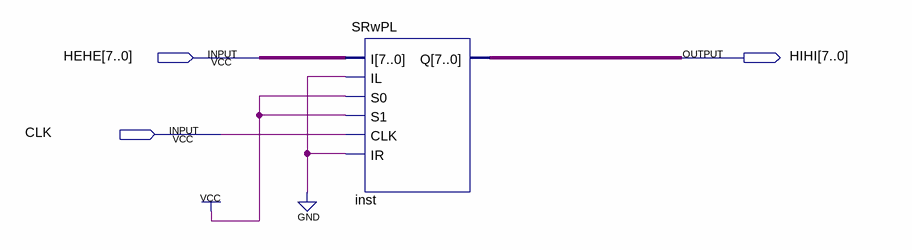
[diagram p0: schematic sheet]
// Quartus schematic TEST.bdf as structural Verilog: 1 symbols, 3 pins
module TEST (
  input  [7:0] HEHE,
  input  CLK,
  output [7:0] HIHI
);

  SRwPL inst (.I(HEHE), .IL(1'b0), .S0(1'b1), .S1(1'b1), .CLK(CLK), .IR(1'b0), .Q(HIHI));
endmodule
